# Altium project QCopterFC.PrjPCB
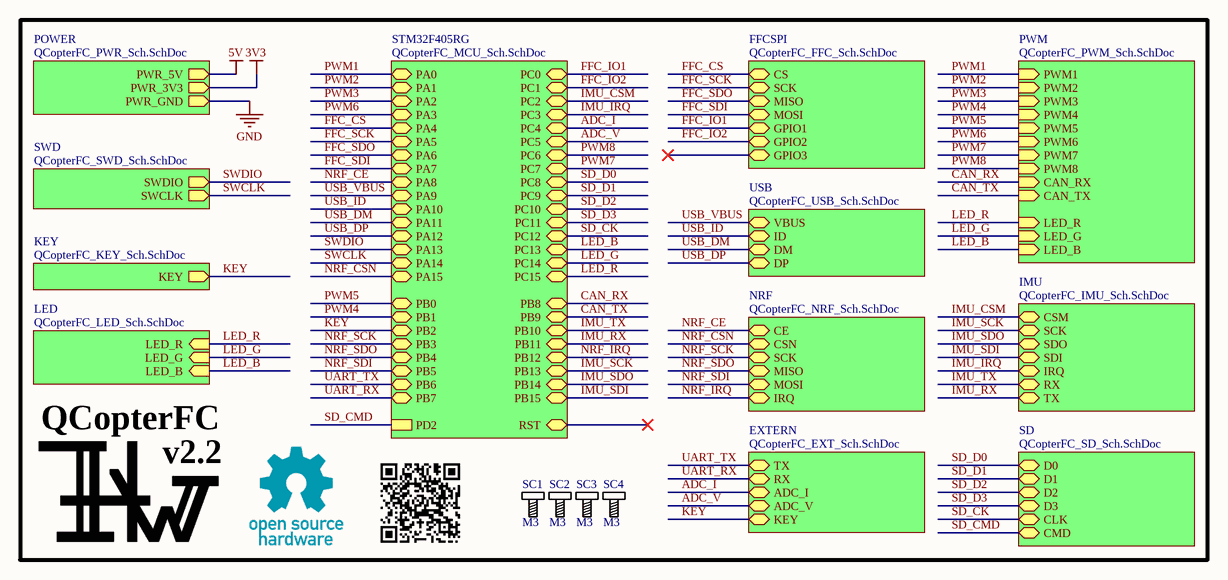
[diagram p0: QCopterFC_MAIN_Sch.SchDoc]
13 sheets, 61 parts. Net scope: hierarchical (ports join the sheet entries above them; power ports are global).
Board file: QCopterFC__Pcb.PcbDoc
Sheets:
  QCopterFC_MAIN_Sch.SchDoc
    FFCSPI = QCopterFC_FFC_Sch.SchDoc
    IMU = QCopterFC_IMU_Sch.SchDoc
    NRF = QCopterFC_NRF_Sch.SchDoc
    POWER = QCopterFC_PWR_Sch.SchDoc
    SWD = QCopterFC_SWD_Sch.SchDoc
    KEY = QCopterFC_KEY_Sch.SchDoc
    LED = QCopterFC_LED_Sch.SchDoc
    PWM = QCopterFC_PWM_Sch.SchDoc
    STM32F405RG = QCopterFC_MCU_Sch.SchDoc
    SD = QCopterFC_SD_Sch.SchDoc
    EXTERN = QCopterFC_EXT_Sch.SchDoc
    USB = QCopterFC_USB_Sch.SchDoc

## Sheet QCopterFC_MAIN_Sch.SchDoc
size A4; PageSetup: Record=PageOptions|CenterHorizontal=True|CenterVertical=True|PrintScale=1.00|XCorrection=1.00|YCorrection=1.00|PrintKind=0|BorderSize=5000000|LeftOffset=0|BottomOffset=0|Orientation=2|PaperLength=1000|PaperWidth=1000|Scale=100|PaperSource=7|PrintQuality=-4|MediaType=1|DitherType=10|PaperKind=A4|PrintScaleMode=1

### Parts
HW  HW  [Logo_HW_v2.0]  (value not drawn)
ORCODE  ORCODE  (value not drawn)
OSHW  OSHW  (value not drawn)
SC1  M3  [SCRREW_M3]
SC2  M3  [SCRREW_M3]
SC3  M3  [SCRREW_M3]
SC4  M3  [SCRREW_M3]

### Blocks framed on the sheet
v2.2: ORCODE OSHW SC1-SC4
QCopterFC: HW

### Sub-sheets
EXTERN = QCopterFC_EXT_Sch.SchDoc: ADC_I, ADC_V, TX, RX, KEY
FFCSPI = QCopterFC_FFC_Sch.SchDoc: MISO, CS, MOSI, SCK, GPIO1, GPIO2, GPIO3
IMU = QCopterFC_IMU_Sch.SchDoc: RX, TX, SDO, SCK, SDI, IRQ, CSM
KEY = QCopterFC_KEY_Sch.SchDoc: KEY (out)
LED = QCopterFC_LED_Sch.SchDoc: LED_R (in), LED_G (in), LED_B (in)
NRF = QCopterFC_NRF_Sch.SchDoc: MISO, MOSI, SCK, CSN, CE, IRQ
POWER = QCopterFC_PWR_Sch.SchDoc: PWR_3V3 (out), PWR_5V (out), PWR_GND (out)
PWM = QCopterFC_PWM_Sch.SchDoc: PWM1 (in), PWM2 (in), PWM3 (in), PWM4 (in), PWM5 (in), PWM6 (in), PWM7 (in), PWM8 (in), CAN_RX (in), CAN_TX (in), LED_R (in), LED_G (in), LED_B (in)
SD = QCopterFC_SD_Sch.SchDoc: D0, CMD, D1, D2, D3, CLK
STM32F405RG = QCopterFC_MCU_Sch.SchDoc: PA0, PA1, PA2, PA3, PA4, PA5, PA6, PA7, PA8, PA9, PA10, PA11, PA12, PA13, PA14, PA15, PB0, PB1, PB2, PB3, PB4, PB5, PB6, PB7, PB8, PB9, PB10, PB11, PB12, PB13, PB14, PB15, PC0, PC1, PC2, PC3, PC4, PC5, PC6, PC7, PC8, PC9, PC10, PC11, PC12, PC13, PC14, PC15, PD2, RST
SWD = QCopterFC_SWD_Sch.SchDoc: SWDIO (out), SWCLK (out)
USB = QCopterFC_USB_Sch.SchDoc: VBUS, ID, DM, DP

### Nets
ADC_I: sheet STM32F405RG/PC4, sheet EXTERN/ADC_I
ADC_V: sheet STM32F405RG/PC5, sheet EXTERN/ADC_V
CAN_RX: sheet PWM/CAN_RX, sheet STM32F405RG/PB8
CAN_TX: sheet PWM/CAN_TX, sheet STM32F405RG/PB9
FFC_CS: sheet FFCSPI/CS, sheet STM32F405RG/PA4
FFC_IO1: sheet FFCSPI/GPIO1, sheet STM32F405RG/PC0
FFC_IO2: sheet FFCSPI/GPIO2, sheet STM32F405RG/PC1
FFC_SCK: sheet FFCSPI/SCK, sheet STM32F405RG/PA5
FFC_SDI: sheet FFCSPI/MOSI, sheet STM32F405RG/PA7
FFC_SDO: sheet FFCSPI/MISO, sheet STM32F405RG/PA6
IMU_CSM: sheet IMU/CSM, sheet STM32F405RG/PC2
IMU_IRQ: sheet IMU/IRQ, sheet STM32F405RG/PC3
IMU_RX: sheet IMU/TX, sheet STM32F405RG/PB11
IMU_SCK: sheet IMU/SCK, sheet STM32F405RG/PB13
IMU_SDI: sheet IMU/SDI, sheet STM32F405RG/PB15
IMU_SDO: sheet IMU/SDO, sheet STM32F405RG/PB14
IMU_TX: sheet IMU/RX, sheet STM32F405RG/PB10
KEY: sheet KEY/KEY, sheet STM32F405RG/PB2, sheet EXTERN/KEY
LED_B: sheet LED/LED_B, sheet PWM/LED_B, sheet STM32F405RG/PC13
LED_G: sheet LED/LED_G, sheet PWM/LED_G, sheet STM32F405RG/PC14
LED_R: sheet LED/LED_R, sheet PWM/LED_R, sheet STM32F405RG/PC15
NRF_CE: sheet NRF/CE, sheet STM32F405RG/PA8
NRF_CSN: sheet NRF/CSN, sheet STM32F405RG/PA15
NRF_IRQ: sheet NRF/IRQ, sheet STM32F405RG/PB12
NRF_SCK: sheet NRF/SCK, sheet STM32F405RG/PB3
NRF_SDI: sheet NRF/MOSI, sheet STM32F405RG/PB5
NRF_SDO: sheet NRF/MISO, sheet STM32F405RG/PB4
PWM1: sheet PWM/PWM1, sheet STM32F405RG/PA0
PWM2: sheet PWM/PWM2, sheet STM32F405RG/PA1
PWM3: sheet PWM/PWM3, sheet STM32F405RG/PA2
PWM4: sheet PWM/PWM4, sheet STM32F405RG/PB1
PWM5: sheet PWM/PWM5, sheet STM32F405RG/PB0
PWM6: sheet PWM/PWM6, sheet STM32F405RG/PA3
PWM7: sheet PWM/PWM7, sheet STM32F405RG/PC7
PWM8: sheet PWM/PWM8, sheet STM32F405RG/PC6
SD_CK: sheet STM32F405RG/PC12, sheet SD/CLK
SD_CMD: sheet STM32F405RG/PD2, sheet SD/CMD
SD_D0: sheet STM32F405RG/PC8, sheet SD/D0
SD_D1: sheet STM32F405RG/PC9, sheet SD/D1
SD_D2: sheet STM32F405RG/PC10, sheet SD/D2
SD_D3: sheet STM32F405RG/PC11, sheet SD/D3
SWCLK: sheet SWD/SWCLK, sheet STM32F405RG/PA14
SWDIO: sheet SWD/SWDIO, sheet STM32F405RG/PA13
UART_RX: sheet STM32F405RG/PB7, sheet EXTERN/RX
UART_TX: sheet STM32F405RG/PB6, sheet EXTERN/TX
USB_DM: sheet STM32F405RG/PA11, sheet USB/DM
USB_DP: sheet STM32F405RG/PA12, sheet USB/DP
USB_ID: sheet STM32F405RG/PA10, sheet USB/ID
USB_VBUS: sheet STM32F405RG/PA9, sheet USB/VBUS

### Library data of the parts
HW = HW: Logo
ORCODE = ORCODE: Logo
OSHW = OSHW: Logo
SC1-SC4 = Screw_M3: Screw

## Sheet QCopterFC_FFC_Sch.SchDoc
size A4
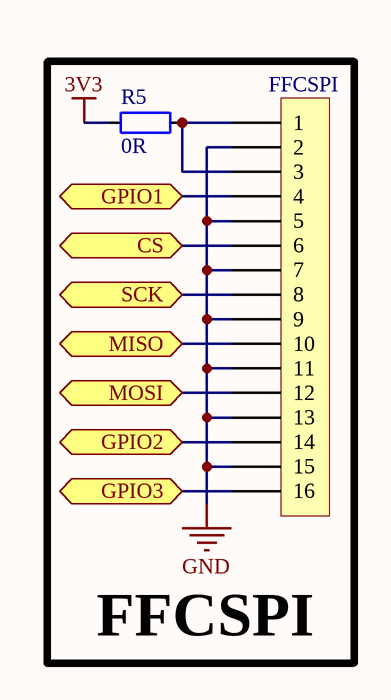
[diagram p1: QCopterFC_FFC_Sch.SchDoc]

### Parts
FFCSPI  FFC_0.5_16  [FFC_0.5_16]  (value not drawn)
R5  value 0R  [RES_0603]  (hidden comment: Res_0603)

### Blocks framed on the sheet
FFCSPI: FFCSPI R5

### Ports
CS, GPIO1, GPIO2, GPIO3, MISO, MOSI, SCK

### Nets
3V3: R5.1
GND: FFCSPI.2 FFCSPI.5 FFCSPI.7 FFCSPI.9 FFCSPI.11 FFCSPI.13 FFCSPI.15
FFC_CS: FFCSPI.6 ; port CS
FFC_IO1: FFCSPI.4 ; port GPIO1
FFC_IO2: FFCSPI.14 ; port GPIO2
FFC_SCK: FFCSPI.8 ; port SCK
FFC_SDI: FFCSPI.12 ; port MOSI
FFC_SDO: FFCSPI.10 ; port MISO
NetFFCSPI_1: FFCSPI.1 FFCSPI.3 R5.2
NetFFCSPI_16: FFCSPI.16 ; port GPIO3

### Library data of the parts
FFCSPI = FFC_0.5_16: FFC
R5 = Res_0603: Resistor

## Sheet QCopterFC_IMU_Sch.SchDoc
size A4
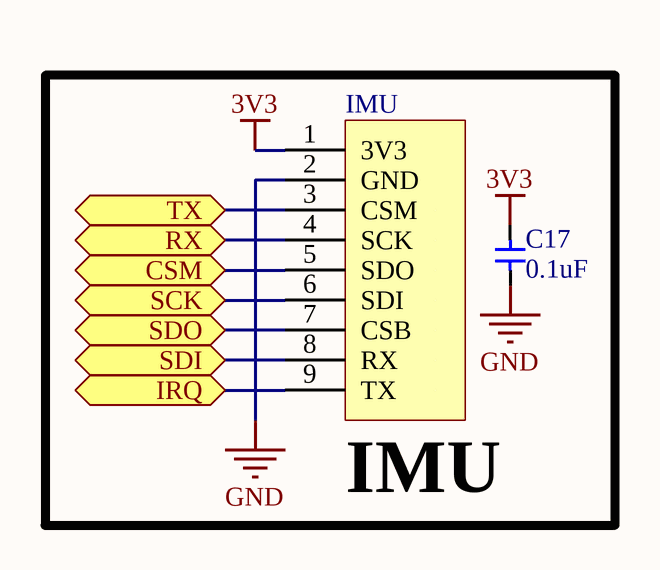
[diagram p2: QCopterFC_IMU_Sch.SchDoc]

### Parts
C17  value 0.1uF  [CAP_0603]  (hidden comment: Cap_0603)
IMU  SmartIMU  [SMART_IMU]  (value not drawn)

### Blocks framed on the sheet
IMU: C17 IMU

### Ports
CSM, IRQ, RX, SCK, SDI, SDO, TX

### Nets
3V3: C17.2 IMU.1(3V3)
GND: C17.1 IMU.2(GND)
IMU_CSM: IMU.5(SDO) ; port CSM
IMU_IRQ: IMU.9(TX) ; port IRQ
IMU_RX: IMU.3(CSM) ; port TX
IMU_SCK: IMU.6(SDI) ; port SCK
IMU_SDI: IMU.8(RX) ; port SDI
IMU_SDO: IMU.7(CSB) ; port SDO
IMU_TX: IMU.4(SCK) ; port RX

Not connected (* = marked no-connect by the designer): IMU 10(NC) 11(NC) 12(NC) 13(NC) 14(NC) 15(NC) 16(NC)

### Library data of the parts
C17 = Cap_0603: Capacitor
IMU = SmartIMU: Module

## Sheet QCopterFC_NRF_Sch.SchDoc
size A4
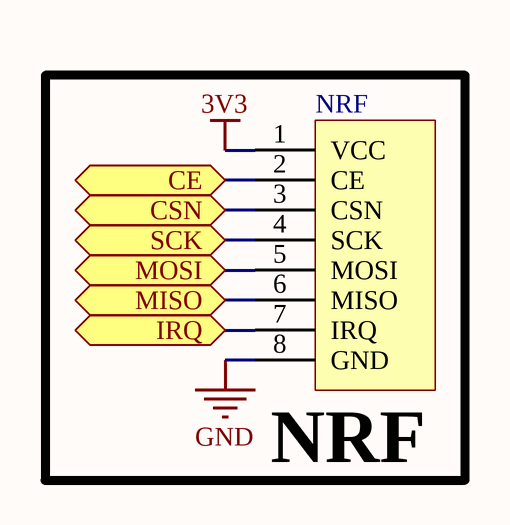
[diagram p3: QCopterFC_NRF_Sch.SchDoc]

### Parts
NRF  nRF24L01P_PA_LNA  [NRF24L01P_PA_LNA]  (value not drawn)

### Blocks framed on the sheet
NRF: NRF

### Ports
CE, CSN, IRQ, MISO, MOSI, SCK

### Nets
3V3: NRF.1(VCC)
GND: NRF.8(GND)
NRF_CE: NRF.2(CE) ; port CE
NRF_CSN: NRF.3(CSN) ; port CSN
NRF_IRQ: NRF.7(IRQ) ; port IRQ
NRF_SCK: NRF.4(SCK) ; port SCK
NRF_SDI: NRF.5(MOSI) ; port MOSI
NRF_SDO: NRF.6(MISO) ; port MISO

### Library data of the parts
NRF = nRF24L01P_PA_LNA: Module

## Sheet QCopterFC_PWR_Sch.SchDoc
size A4
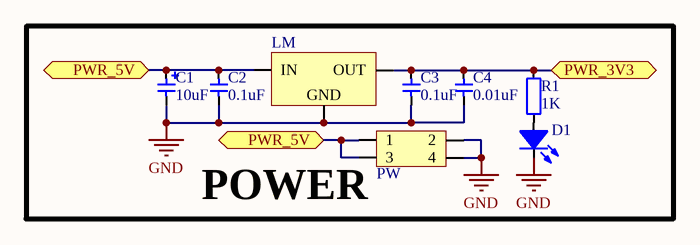
[diagram p4: QCopterFC_PWR_Sch.SchDoc]

### Parts
C1  value 10uF  [CAP_TAN_B1210]  (hidden comment: Cap_Tan_1210)
C2  value 0.1uF  [CAP_0603]  (hidden comment: Cap_0603)
C3  value 0.1uF  [CAP_0603]  (hidden comment: Cap_0603)
C4  value 0.01uF  [CAP_0603]  (hidden comment: Cap_0603)
D1  LED_0603  [LED_0603_WHITE]  (value not drawn)
LM  LM1117  [SOT223]  (value not drawn)
PW  HDR2X2_90_2.54  [HDR2X2_90_2.54]  (value not drawn)
R1  value 1K  [RES_0603]  (hidden comment: Res_0603)

### Blocks framed on the sheet
POWER: C1-C4 D1 LM PW R1

### Ports
PWR_3V3, PWR_5V

### Nets
3V3: C3.2 C4.2 LM.2(OUT) R1.2 ; port PWR_3V3
5V: C1.1 C2.2 LM.3(IN) PW.1 PW.3 ; port PWR_5V
GND: C1.2 C2.1 C3.1 C4.1 D1.2(K) LM.1(GND) PW.2 PW.4
NetD1_1: D1.1(A) R1.1

### Library data of the parts
C1 = Cap_Tan_1210: Capacitor
C2-C4 = Cap_0603: Capacitor
D1 = LED_0603: LED
LM = LM1117: Power
PW = HDR2X2_90_2.54: Header
R1 = Res_0603: Resistor

## Sheet QCopterFC_SWD_Sch.SchDoc
size A4
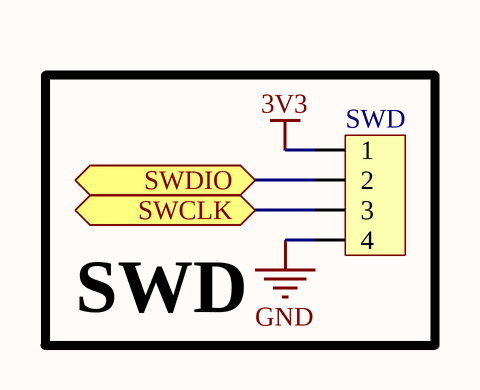
[diagram p5: QCopterFC_SWD_Sch.SchDoc]

### Parts
SWD  HDR1X4_90F_2.54  [HDR1X4_90F_2.54]  (value not drawn)

### Blocks framed on the sheet
SWD: SWD

### Ports
SWCLK, SWDIO

### Nets
3V3: SWD.1
GND: SWD.4
SWCLK: SWD.3 ; port SWCLK
SWDIO: SWD.2 ; port SWDIO

### Library data of the parts
SWD = HDR1X4_90F_2.54: Header

## Sheet QCopterFC_KEY_Sch.SchDoc
size A4
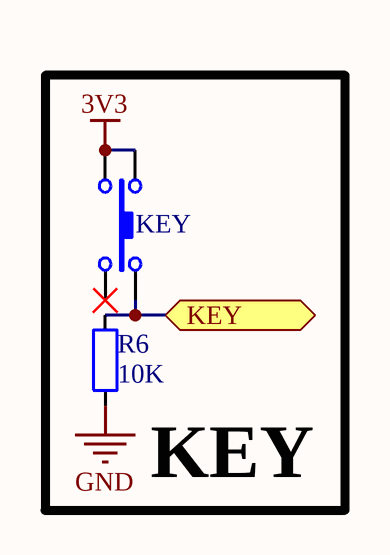
[diagram p6: QCopterFC_KEY_Sch.SchDoc]

### Parts
KEY  BT_TACT_3.5*5_90  [BT_TACT_3.5*3.55_90]  (value not drawn)
R6  value 10K  [RES_0603]  (hidden comment: Res_0603)

### Blocks framed on the sheet
KEY: KEY R6

### Ports
KEY

### Nets
3V3: KEY.1 KEY.3
GND: R6.1
KEY: KEY.2 R6.2 ; port KEY

Not connected (* = marked no-connect by the designer): KEY 4*

### Library data of the parts
KEY = BT_TACT_3.5*5_90: Switch
R6 = Res_0603: Resistor

## Sheet QCopterFC_LED_Sch.SchDoc
size A4
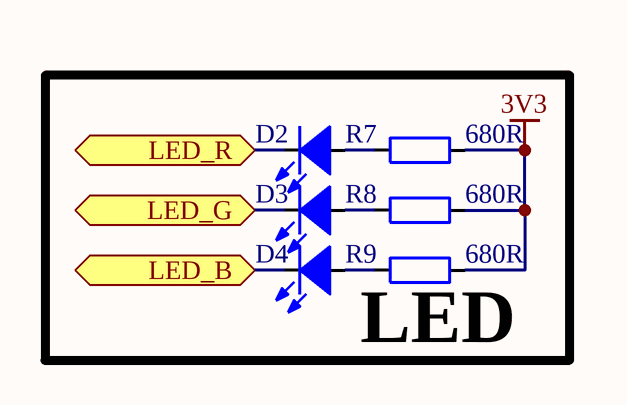
[diagram p7: QCopterFC_LED_Sch.SchDoc]

### Parts
D2  LED_0603  [LED_0603_RED]  (value not drawn)
D3  LED_0603  [LED_0603_GREEN]  (value not drawn)
D4  LED_0603  [LED_0603_BLUE]  (value not drawn)
R7  value 680R  [RES_0603]  (hidden comment: Res_0603)
R8  value 680R  [RES_0603]  (hidden comment: Res_0603)
R9  value 680R  [RES_0603]  (hidden comment: Res_0603)

### Blocks framed on the sheet
LED: D2-D4 R7-R9

### Ports
LED_B, LED_G, LED_R

### Nets
3V3: R7.1 R8.1 R9.1
LED_B: D4.2(K) ; port LED_B
LED_G: D3.2(K) ; port LED_G
LED_R: D2.2(K) ; port LED_R
NetD2_1: D2.1(A) R7.2
NetD3_1: D3.1(A) R8.2
NetD4_1: D4.1(A) R9.2

### Library data of the parts
D2-D4 = LED_0603: LED
R7-R9 = Res_0603: Resistor

## Sheet QCopterFC_PWM_Sch.SchDoc
size A4
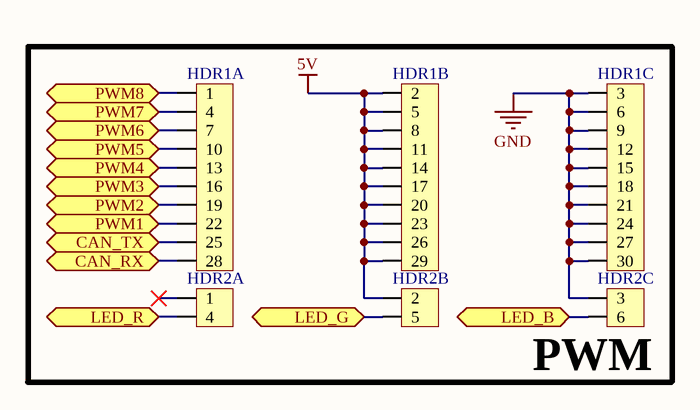
[diagram p8: QCopterFC_PWM_Sch.SchDoc]

### Parts
HDR1  HDR3X10_90_2.54  [HDR3X10_90_2.54]  (value not drawn)  (parts A,B,C of 3)
HDR2  HDR3X2_90_2.54  [HDR3X2_90_2.54]  (value not drawn)  (parts A,B,C of 3)

### Blocks framed on the sheet
PWM: HDR1 HDR2

### Ports
CAN_RX, CAN_TX, LED_B, LED_G, LED_R, PWM1, PWM2, PWM3, PWM4, PWM5, PWM6, PWM7, PWM8

### Nets
5V: HDR1.2 HDR1.5 HDR1.8 HDR1.11 HDR1.14 HDR1.17 HDR1.20 HDR1.23 HDR1.26 HDR1.29 HDR2.2
GND: HDR1.3 HDR1.6 HDR1.9 HDR1.12 HDR1.15 HDR1.18 HDR1.21 HDR1.24 HDR1.27 HDR1.30 HDR2.3
CAN_RX: HDR1.28 ; port CAN_RX
CAN_TX: HDR1.25 ; port CAN_TX
LED_B: HDR2.6 ; port LED_B
LED_G: HDR2.5 ; port LED_G
LED_R: HDR2.4 ; port LED_R
PWM1: HDR1.22 ; port PWM1
PWM2: HDR1.19 ; port PWM2
PWM3: HDR1.16 ; port PWM3
PWM4: HDR1.13 ; port PWM4
PWM5: HDR1.10 ; port PWM5
PWM6: HDR1.7 ; port PWM6
PWM7: HDR1.4 ; port PWM7
PWM8: HDR1.1 ; port PWM8

Not connected (* = marked no-connect by the designer): HDR2 1*

### Library data of the parts
HDR1 = HDR3X10_90_2.54: Header
HDR2 = HDR3X2_90_2.54: Header

## Sheet QCopterFC_MCU_Sch.SchDoc
size A4
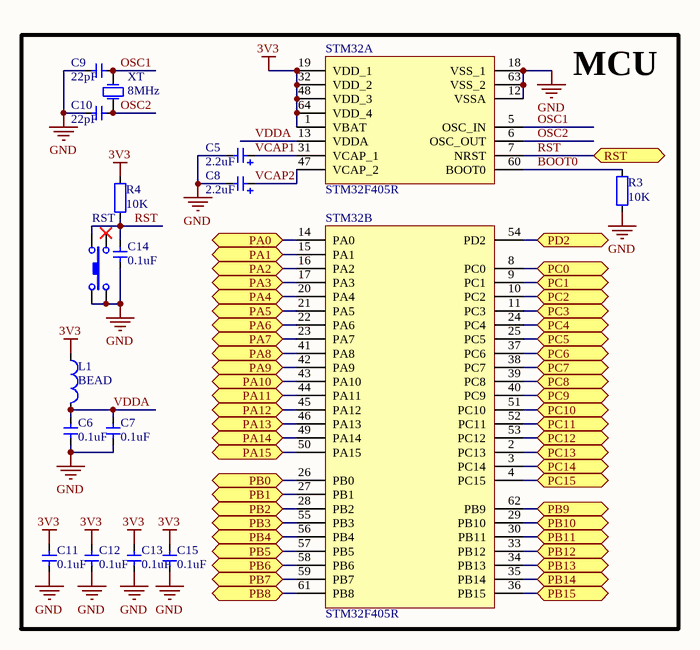
[diagram p9: QCopterFC_MCU_Sch.SchDoc]

### Parts
C5  value 2.2uF  [CAP_TAN_P0805]  (hidden comment: Cap_Tan_0805)
C6  value 0.1uF  [CAP_0603]  (hidden comment: Cap_0603)
C7  value 0.1uF  [CAP_0603]  (hidden comment: Cap_0603)
C8  value 2.2uF  [CAP_TAN_P0805]  (hidden comment: Cap_Tan_0805)
C9  value 22pF  [CAP_0603]  (hidden comment: Cap_0603)
C10  value 22pF  [CAP_0603]  (hidden comment: Cap_0603)
C11  value 0.1uF  [CAP_0603]  (hidden comment: Cap_0603)
C12  value 0.1uF  [CAP_0603]  (hidden comment: Cap_0603)
C13  value 0.1uF  [CAP_0603]  (hidden comment: Cap_0603)
C14  value 0.1uF  [CAP_0603]  (hidden comment: Cap_0603)
C15  value 0.1uF  [CAP_0603]  (hidden comment: Cap_0603)
L1  value BEAD  [IND_0603]  (hidden comment: Ind_0603)
R3  value 10K  [RES_0603]  (hidden comment: Res_0603)
R4  value 10K  [RES_0603]  (hidden comment: Res_0603)
RST  BT_TACT_3.5*5_90  [BT_TACT_3.5*3.55_90]  (value not drawn)
STM32  STM32F405R  [STM32_QFP64]  (parts A,B of 2)
XT  value 8MHz  [XTAL_5032]  (hidden comment: XTAL_5032_2P)

### Blocks framed on the sheet
MCU: C5-C15 L1 R3 R4 RST STM32 XT

### Ports
PA0, PA1, PA2, PA3, PA4, PA5, PA6, PA7, PA8, PA9, PA10, PA11, PA12, PA13, PA14, PA15, PB0, PB1, PB2, PB3, PB4, PB5, PB6, PB7, PB8, PB9, PB10, PB11, PB12, PB13, PB14, PB15, PC0, PC1, PC2, PC3, PC4, PC5, PC6, PC7, PC8, PC9, PC10, PC11, PC12, PC13, PC14, PC15, PD2, RST

### Nets
3V3: C11.1 C12.1 C13.1 C15.1 L1.1 R4.2 STM32.1(VBAT) STM32.19(VDD_1) STM32.32(VDD_2) STM32.48(VDD_3) STM32.64(VDD_4)
GND: C5.2 C6.1 C7.1 C8.2 C9.1 C10.1 C11.2 C12.2 C13.2 C14.2 C15.2 R3.1 RST.1 RST.3 STM32.12(VSSA) STM32.18(VSS_1) STM32.63(VSS_2)
ADC_I: STM32.24(PC4) ; port PC4
ADC_V: STM32.25(PC5) ; port PC5
BOOT0: R3.2 STM32.60(BOOT0)
CAN_RX: STM32.61(PB8) ; port PB8
CAN_TX: STM32.62(PB9) ; port PB9
FFC_CS: STM32.20(PA4) ; port PA4
FFC_IO1: STM32.8(PC0) ; port PC0
FFC_IO2: STM32.9(PC1) ; port PC1
FFC_SCK: STM32.21(PA5) ; port PA5
FFC_SDI: STM32.23(PA7) ; port PA7
FFC_SDO: STM32.22(PA6) ; port PA6
IMU_CSM: STM32.10(PC2) ; port PC2
IMU_IRQ: STM32.11(PC3) ; port PC3
IMU_RX: STM32.30(PB11) ; port PB11
IMU_SCK: STM32.34(PB13) ; port PB13
IMU_SDI: STM32.36(PB15) ; port PB15
IMU_SDO: STM32.35(PB14) ; port PB14
IMU_TX: STM32.29(PB10) ; port PB10
KEY: STM32.28(PB2) ; port PB2
LED_B: STM32.2(PC13) ; port PC13
LED_G: STM32.3(PC14) ; port PC14
LED_R: STM32.4(PC15) ; port PC15
NRF_CE: STM32.41(PA8) ; port PA8
NRF_CSN: STM32.50(PA15) ; port PA15
NRF_IRQ: STM32.33(PB12) ; port PB12
NRF_SCK: STM32.55(PB3) ; port PB3
NRF_SDI: STM32.57(PB5) ; port PB5
NRF_SDO: STM32.56(PB4) ; port PB4
OSC1: C9.2 STM32.5(OSC_IN) XT.2(OSC2)
OSC2: C10.2 STM32.6(OSC_OUT) XT.1(OSC1)
PWM1: STM32.14(PA0) ; port PA0
PWM2: STM32.15(PA1) ; port PA1
PWM3: STM32.16(PA2) ; port PA2
PWM4: STM32.27(PB1) ; port PB1
PWM5: STM32.26(PB0) ; port PB0
PWM6: STM32.17(PA3) ; port PA3
PWM7: STM32.38(PC7) ; port PC7
PWM8: STM32.37(PC6) ; port PC6
RST: C14.1 R4.1 RST.2 STM32.7(NRST) ; port RST
SD_CK: STM32.53(PC12) ; port PC12
SD_CMD: STM32.54(PD2) ; port PD2
SD_D0: STM32.39(PC8) ; port PC8
SD_D1: STM32.40(PC9) ; port PC9
SD_D2: STM32.51(PC10) ; port PC10
SD_D3: STM32.52(PC11) ; port PC11
SWCLK: STM32.49(PA14) ; port PA14
SWDIO: STM32.46(PA13) ; port PA13
UART_RX: STM32.59(PB7) ; port PB7
UART_TX: STM32.58(PB6) ; port PB6
USB_DM: STM32.44(PA11) ; port PA11
USB_DP: STM32.45(PA12) ; port PA12
USB_ID: STM32.43(PA10) ; port PA10
USB_VBUS: STM32.42(PA9) ; port PA9
VCAP1: C5.1 STM32.31(VCAP_1)
VCAP2: C8.1 STM32.47(VCAP_2)
VDDA: C6.2 C7.2 L1.2 STM32.13(VDDA)

Not connected (* = marked no-connect by the designer): RST 4*

### Library data of the parts
C5 C8 = Cap_Tan_0805: Capacitor
C6 C7 C9-C15 = Cap_0603: Capacitor
L1 = Ind_0603: Inductor
R3 R4 = Res_0603: Resistor
RST = BT_TACT_3.5*5_90: Switch
STM32 = STM32F405R: MCU
XT = XTAL_5032_2P: Crystal Oscillator

## Sheet QCopterFC_SD_Sch.SchDoc
size A4
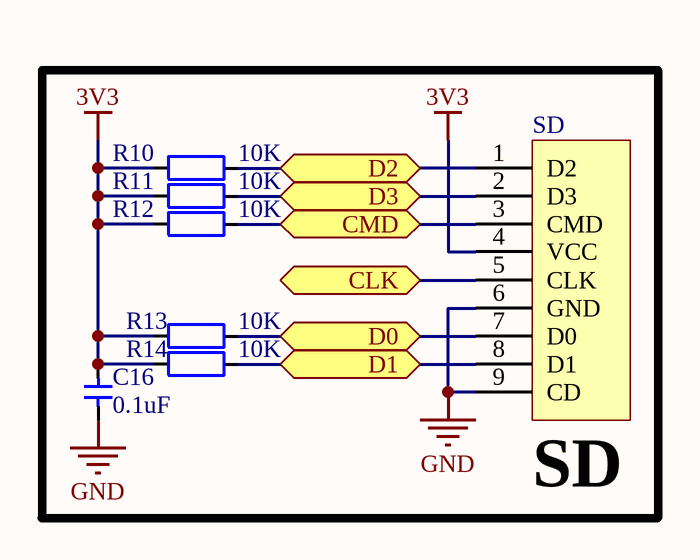
[diagram p10: QCopterFC_SD_Sch.SchDoc]

### Parts
C16  value 0.1uF  [CAP_0603]  (hidden comment: Cap_0603)
R10  value 10K  [RES_0603]  (hidden comment: Res_0603)
R11  value 10K  [RES_0603]  (hidden comment: Res_0603)
R12  value 10K  [RES_0603]  (hidden comment: Res_0603)
R13  value 10K  [RES_0603]  (hidden comment: Res_0603)
R14  value 10K  [RES_0603]  (hidden comment: Res_0603)
SD  SD_Card_TF  [SD_Card_TF]  (value not drawn)

### Ports
CLK, CMD, D0, D1, D2, D3

### Nets
3V3: C16.2 R10.2 R11.2 R12.2 R13.2 R14.2 SD.4(VCC)
GND: C16.1 SD.6(GND) SD.9(CD)
SD_CK: SD.5(CLK) ; port CLK
SD_CMD: R12.1 SD.3(CMD) ; port CMD
SD_D0: R13.1 SD.7(D0) ; port D0
SD_D1: R14.1 SD.8(D1) ; port D1
SD_D2: R10.1 SD.1(D2) ; port D2
SD_D3: R11.1 SD.2(D3) ; port D3

### Notes on the sheet
- Labels drawn without touching a wire or pin: SD

### Library data of the parts
C16 = Cap_0603: Capacitor
R10-R14 = Res_0603: Resistor
SD = SD_Card_TF: SD

## Sheet QCopterFC_EXT_Sch.SchDoc
size A4
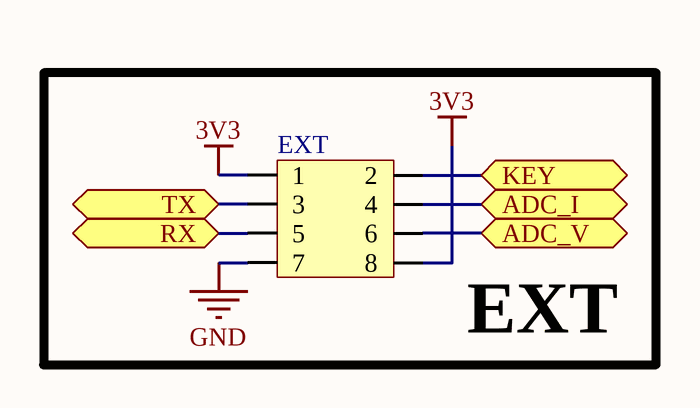
[diagram p11: QCopterFC_EXT_Sch.SchDoc]

### Parts
EXT  HDR2X4_90_2.54  [HDR2X4_90_2.54]  (value not drawn)

### Ports
ADC_I, ADC_V, KEY, RX, TX

### Nets
3V3: EXT.1 EXT.8
GND: EXT.7
ADC_I: EXT.4 ; port ADC_I
ADC_V: EXT.6 ; port ADC_V
KEY: EXT.2 ; port KEY
UART_RX: EXT.5 ; port RX
UART_TX: EXT.3 ; port TX

### Notes on the sheet
- Labels drawn without touching a wire or pin: EXT

### Library data of the parts
EXT = HDR2X4_90_2.54: Header

## Sheet QCopterFC_USB_Sch.SchDoc
size A4
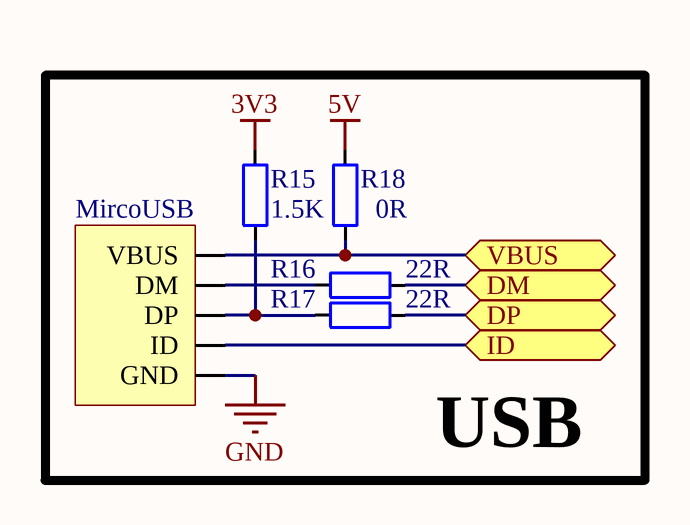
[diagram p12: QCopterFC_USB_Sch.SchDoc]

### Parts
MircoUSB  USB_Micro  [USB_Micro-AB]  (value not drawn)
R15  value 1.5K  [RES_0603]  (hidden comment: Res_0603)
R16  value 22R  [RES_0603]  (hidden comment: Res_0603)
R17  value 22R  [RES_0603]  (hidden comment: Res_0603)
R18  value 0R  [RES_0603]  (hidden comment: Res_0603)

### Blocks framed on the sheet
USB: MircoUSB R15-R18

### Ports
DM, DP, ID, VBUS

### Nets
3V3: R15.2
5V: R18.2
GND: MircoUSB.5(GND)
USB_DM: R16.1 ; port DM
USB_DP: R17.1 ; port DP
USB_ID: MircoUSB.4(ID) ; port ID
USB_VBUS: MircoUSB.1(VBUS) R18.1 ; port VBUS
NetMircoUSB_2: MircoUSB.2(DM) R16.2
NetMircoUSB_3: MircoUSB.3(DP) R15.1 R17.2

### Library data of the parts
MircoUSB = USB_Micro: USB
R15-R18 = Res_0603: Resistor

## Nets that join several sheets
3V3: QCopterFC_FFC_Sch (R5.1), QCopterFC_IMU_Sch (C17.2 IMU.1), QCopterFC_NRF_Sch (NRF.1), QCopterFC_PWR_Sch (C3.2 C4.2 LM.2 R1.2), QCopterFC_SWD_Sch (SWD.1), QCopterFC_KEY_Sch (KEY.1 KEY.3), QCopterFC_LED_Sch (R7.1 R8.1 R9.1), QCopterFC_MCU_Sch (11 pins), QCopterFC_SD_Sch (7 pins), QCopterFC_EXT_Sch (EXT.1 EXT.8), QCopterFC_USB_Sch (R15.2)
5V: QCopterFC_PWR_Sch (5 pins), QCopterFC_PWM_Sch (11 pins), QCopterFC_USB_Sch (R18.2)
GND: QCopterFC_FFC_Sch (7 pins), QCopterFC_IMU_Sch (C17.1 IMU.2), QCopterFC_NRF_Sch (NRF.8), QCopterFC_PWR_Sch (8 pins), QCopterFC_SWD_Sch (SWD.4), QCopterFC_KEY_Sch (R6.1), QCopterFC_PWM_Sch (11 pins), QCopterFC_MCU_Sch (17 pins), QCopterFC_SD_Sch (C16.1 SD.6 SD.9), QCopterFC_EXT_Sch (EXT.7), QCopterFC_USB_Sch (MircoUSB.5)
ADC_I: QCopterFC_MCU_Sch (STM32.24), QCopterFC_EXT_Sch (EXT.4)
ADC_V: QCopterFC_MCU_Sch (STM32.25), QCopterFC_EXT_Sch (EXT.6)
CAN_RX: QCopterFC_PWM_Sch (HDR1.28), QCopterFC_MCU_Sch (STM32.61)
CAN_TX: QCopterFC_PWM_Sch (HDR1.25), QCopterFC_MCU_Sch (STM32.62)
FFC_CS: QCopterFC_FFC_Sch (FFCSPI.6), QCopterFC_MCU_Sch (STM32.20)
FFC_IO1: QCopterFC_FFC_Sch (FFCSPI.4), QCopterFC_MCU_Sch (STM32.8)
FFC_IO2: QCopterFC_FFC_Sch (FFCSPI.14), QCopterFC_MCU_Sch (STM32.9)
FFC_SCK: QCopterFC_FFC_Sch (FFCSPI.8), QCopterFC_MCU_Sch (STM32.21)
FFC_SDI: QCopterFC_FFC_Sch (FFCSPI.12), QCopterFC_MCU_Sch (STM32.23)
FFC_SDO: QCopterFC_FFC_Sch (FFCSPI.10), QCopterFC_MCU_Sch (STM32.22)
IMU_CSM: QCopterFC_IMU_Sch (IMU.5), QCopterFC_MCU_Sch (STM32.10)
IMU_IRQ: QCopterFC_IMU_Sch (IMU.9), QCopterFC_MCU_Sch (STM32.11)
IMU_RX: QCopterFC_IMU_Sch (IMU.3), QCopterFC_MCU_Sch (STM32.30)
IMU_SCK: QCopterFC_IMU_Sch (IMU.6), QCopterFC_MCU_Sch (STM32.34)
IMU_SDI: QCopterFC_IMU_Sch (IMU.8), QCopterFC_MCU_Sch (STM32.36)
IMU_SDO: QCopterFC_IMU_Sch (IMU.7), QCopterFC_MCU_Sch (STM32.35)
IMU_TX: QCopterFC_IMU_Sch (IMU.4), QCopterFC_MCU_Sch (STM32.29)
KEY: QCopterFC_KEY_Sch (KEY.2 R6.2), QCopterFC_MCU_Sch (STM32.28), QCopterFC_EXT_Sch (EXT.2)
LED_B: QCopterFC_LED_Sch (D4.2), QCopterFC_PWM_Sch (HDR2.6), QCopterFC_MCU_Sch (STM32.2)
LED_G: QCopterFC_LED_Sch (D3.2), QCopterFC_PWM_Sch (HDR2.5), QCopterFC_MCU_Sch (STM32.3)
LED_R: QCopterFC_LED_Sch (D2.2), QCopterFC_PWM_Sch (HDR2.4), QCopterFC_MCU_Sch (STM32.4)
NRF_CE: QCopterFC_NRF_Sch (NRF.2), QCopterFC_MCU_Sch (STM32.41)
NRF_CSN: QCopterFC_NRF_Sch (NRF.3), QCopterFC_MCU_Sch (STM32.50)
NRF_IRQ: QCopterFC_NRF_Sch (NRF.7), QCopterFC_MCU_Sch (STM32.33)
NRF_SCK: QCopterFC_NRF_Sch (NRF.4), QCopterFC_MCU_Sch (STM32.55)
NRF_SDI: QCopterFC_NRF_Sch (NRF.5), QCopterFC_MCU_Sch (STM32.57)
NRF_SDO: QCopterFC_NRF_Sch (NRF.6), QCopterFC_MCU_Sch (STM32.56)
PWM1: QCopterFC_PWM_Sch (HDR1.22), QCopterFC_MCU_Sch (STM32.14)
PWM2: QCopterFC_PWM_Sch (HDR1.19), QCopterFC_MCU_Sch (STM32.15)
PWM3: QCopterFC_PWM_Sch (HDR1.16), QCopterFC_MCU_Sch (STM32.16)
PWM4: QCopterFC_PWM_Sch (HDR1.13), QCopterFC_MCU_Sch (STM32.27)
PWM5: QCopterFC_PWM_Sch (HDR1.10), QCopterFC_MCU_Sch (STM32.26)
PWM6: QCopterFC_PWM_Sch (HDR1.7), QCopterFC_MCU_Sch (STM32.17)
PWM7: QCopterFC_PWM_Sch (HDR1.4), QCopterFC_MCU_Sch (STM32.38)
PWM8: QCopterFC_PWM_Sch (HDR1.1), QCopterFC_MCU_Sch (STM32.37)
SD_CK: QCopterFC_MCU_Sch (STM32.53), QCopterFC_SD_Sch (SD.5)
SD_CMD: QCopterFC_MCU_Sch (STM32.54), QCopterFC_SD_Sch (R12.1 SD.3)
SD_D0: QCopterFC_MCU_Sch (STM32.39), QCopterFC_SD_Sch (R13.1 SD.7)
SD_D1: QCopterFC_MCU_Sch (STM32.40), QCopterFC_SD_Sch (R14.1 SD.8)
SD_D2: QCopterFC_MCU_Sch (STM32.51), QCopterFC_SD_Sch (R10.1 SD.1)
SD_D3: QCopterFC_MCU_Sch (STM32.52), QCopterFC_SD_Sch (R11.1 SD.2)
SWCLK: QCopterFC_SWD_Sch (SWD.3), QCopterFC_MCU_Sch (STM32.49)
SWDIO: QCopterFC_SWD_Sch (SWD.2), QCopterFC_MCU_Sch (STM32.46)
UART_RX: QCopterFC_MCU_Sch (STM32.59), QCopterFC_EXT_Sch (EXT.5)
UART_TX: QCopterFC_MCU_Sch (STM32.58), QCopterFC_EXT_Sch (EXT.3)
USB_DM: QCopterFC_MCU_Sch (STM32.44), QCopterFC_USB_Sch (R16.1)
USB_DP: QCopterFC_MCU_Sch (STM32.45), QCopterFC_USB_Sch (R17.1)
USB_ID: QCopterFC_MCU_Sch (STM32.43), QCopterFC_USB_Sch (MircoUSB.4)
USB_VBUS: QCopterFC_MCU_Sch (STM32.42), QCopterFC_USB_Sch (MircoUSB.1 R18.1)